# Altium project Farm_Pump.PrjPcb (part 2 of 2)

## Sheet STM32F038G6U6.SchDoc
size A4; SheetNumber: 12; SheetTotal: 13
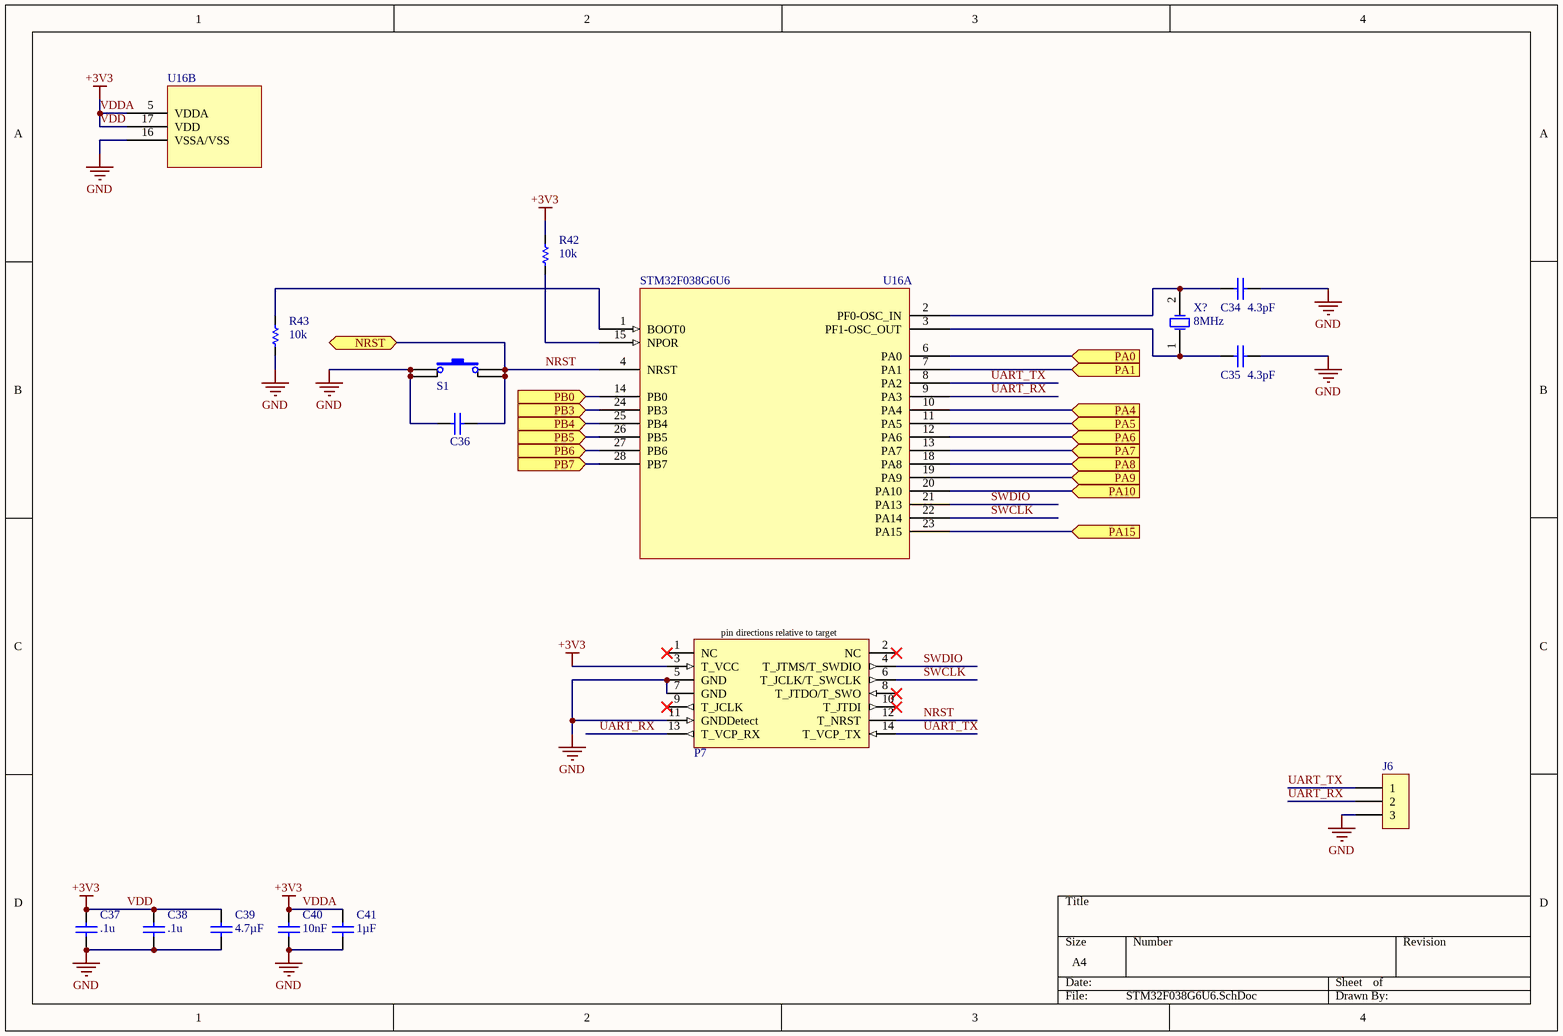
[diagram p12: STM32F038G6U6.SchDoc]

### Parts
C34  4.3pF  [0603C]
C35  4.3pF  [0603C]
C36  .1u  [0402c]  (value not drawn)
C37  .1u  [0402c]
C38  .1u  [0402c]
C39  4.7µF  [0603C]
C40  10nF  [0603C]
C41  1µF  [0603C]
J6  HDR3POS  [HDR 1x3 2.54MM]  (value not drawn)  (no BOM)
P7  HDR14POS  [Header_14pin_JTAG]  (value not drawn)
R42  10k  [0603R]
R43  10k  [0603R]
S1  SMT  [PTS645SM43SMTR92]  (value not drawn)
U16  STM32F038G6U6  [STM32F038G6U6]  (parts A,B of 2)
X?  8MHz  [OSC_2SM_3R2X1R5]

### Ports
NRST (bidir), PA0 (in), PA1 (in), PA4 (in), PA5 (in), PA6 (in), PA7 (in), PA8 (in), PA9 (in), PA10 (in), PA15 (in), PB0 (in), PB3 (in), PB4 (in), PB5 (in), PB6 (in), PB7 (in)

### Nets
GND: C34.2 C35.2 C36.1 C37.2 C38.2 C39.2 C40.2 C41.2 J6.3 P7.5(GND) P7.7(GND) P7.11(GNDDetect) R43.1 S1.1 S1.2 U16.16(VSSA/VSS)
VDD: C37.1 C38.1 C39.1 C40.1 C41.1 P7.3(T_VCC) R42.2 U16.5(VDDA) U16.17(VDD)  [also labelled +3V3, VDDA]
AC_Enabled: U16.25(PB4) ; port PB4
Alert: U16.23(PA15) ; port PA15
HV_SENSE_NEG: U16.7(PA1) ; port PA1
HV_SENSE_POS: U16.6(PA0) ; port PA0
I2C_SCL: U16.19(PA9) ; port PA9
I2C_SDA: U16.20(PA10) ; port PA10
NRST: C36.2 P7.12(T_NRST) S1.3 S1.4 U16.4(NRST) ; port NRST
ON_OFF: U16.26(PB5) ; port PB5
SWCLK: P7.6(T_JCLK/T_SWCLK) U16.22(PA14)
SWDIO: P7.4(T_JTMS/T_SWDIO) U16.21(PA13)
UART_RX: J6.2 P7.13(T_VCP_RX) U16.9(PA3)
UART_TX: J6.1 P7.14(T_VCP_TX) U16.8(PA2)
NetC34_1: C34.1 U16.2(PF0-OSC_IN) X?.2(OSC2)
NetC35_1: C35.1 U16.3(PF1-OSC_OUT) X?.1(OSC1)
NetR1_2: U16.24(PB3) ; port PB3
NetR2_1: U16.10(PA4) ; port PA4
NetR4_1: U16.11(PA5) ; port PA5
NetR6_2: U16.12(PA6) ; port PA6
NetR7_1: U16.13(PA7) ; port PA7
NetR20_1: U16.18(PA8) ; port PA8
NetR24_2: U16.27(PB6) ; port PB6
NetR42_1: R42.1 U16.15(NPOR)
NetR43_2: R43.2 U16.1(BOOT0)
NetR?#1_1: U16.14(PB0) ; port PB0
NetU3_7: U16.28(PB7) ; port PB7

Not connected (* = marked no-connect by the designer): P7 1(NC)* 2(NC)* 8(T_JTDO/T_SWO)* 9(T_JCLK)* 10(T_JTDI)*

### Notes on the sheet
- (in symbol 1005-0008) pin directions relative to target

### Library data of the parts
C34 C35 = 1000-0050: CAP CER 4.3PF 50V NPO 0603; Manufacturer: Yageo; Manufacturer Part Number: CC0603CRNPO9BN4R3; id: 377966; inventory_price: 0.02062; x_Link_Description: Datasheet; x_max_temp: 125°C; x_min_temp: -55°C; x_Tolerance: ±0.25pF; partnumber: 1000-0050; created_on: 31/03/2020 1:35:31 PM; parttype: Ceramic Capacitors; rohs: 1; updated_on: 24/08/2021 12:09:55 PM; x_Capacitance: 4.3pF; x_Link_URL: https://www.yageo.com/upload/media/product/productsearch/datasheet/mlcc/UPY-GP_NP0_16V-to-50V_18.pdf
C36-C38 = 1000-0015: CAP CER 0.1UF 16V X7R 0402; Manufacturer: TDK Corporation; Manufacturer Part Number: C1005X7R1C104K050BC; id: 310046; inventory_price: 0.0202; x_Capacitance: 0.1µF; x_Link_Description: Datasheet; x_max_temp: 125°C; x_min_temp: -55°C; x_Tolerance: ±10%; Value: .1u; partnumber: 1000-0015; created_on: 8/04/2019 9:50:39 AM; parttype: Ceramic Capacitors; rohs: 1; updated_on: 24/08/2021 12:09:53 PM; x_Link_URL: https://product.tdk.com/info/en/catalog/datasheets/mlcc_commercial_general_en.pdf?ref_disty=digikey
C39 = 1000-0095: CAP CER 4.7UF 16V X5R 0603; Manufacturer: TDK Corporation; Manufacturer Part Number: C1608X5R1C475K080AC; id: 427012; inventory_price: 0.1659; x_Link_Description: Datasheet; x_max_temp: 85°C; x_min_temp: -55°C; x_Tolerance: ±10%; partnumber: 1000-0095; created_on: 8/04/2021 12:25:47 PM; parttype: Ceramic Capacitors; rohs: 1; updated_on: 10/08/2021 1:17:22 PM; x_Capacitance: 4.7µF; x_Link_URL: https://product.tdk.com/info/en/catalog/datasheets/mlcc_commercial_general_en.pdf?ref_disty=digikey; x_temp_coef: X5R; x_Vol: 16V
C40 = 1000-0001: CAP CER 10000PF 50V X7R 0603; Manufacturer: Walsin Technology Corporation; Manufacturer Part Number: 0603B103K500CT; id: 376107; inventory_price: 0.1; x_current: Not Applicable; x_Link_Description: Datasheet; x_max_temp: 125°C; x_min_temp: -55°C; x_port_to_unleashed: No; x_Tolerance: ±10%; partnumber: 1000-0001; created_on: 4/03/2020 6:31:45 PM; parttype: Ceramic Capacitors; rohs: 1; updated_on: 9/02/2022 10:33:24 AM; x_Capacitance: 10000 pF; x_inductance: Not Applicable; x_Link_URL: https://www.vishay.com/docs/28548/vjw1bcbascomseries.pdf; x_Power: Not Applicable; x_resistance: Not Applicable; x_temp_coef: X7R; x_Vol: 50V
C41 = 1000-0094: CAP CER 1UF 25V X5R 0603; Manufacturer: Yageo; Manufacturer Part Number: CC0603KRX5R8BB105; id: 427010; inventory_price: 0.03236; x_Link_Description: Datasheet; x_max_temp: 85°C; x_min_temp: -55°C; x_Tolerance: ±10%; partnumber: 1000-0094; created_on: 8/04/2021 12:21:35 PM; parttype: Ceramic Capacitors; rohs: 1; updated_on: 24/08/2021 12:09:56 PM; x_Capacitance: 1µF; x_Link_URL: https://www.yageo.com/upload/media/product/productsearch/datasheet/mlcc/UPY-GPHC_X5R_4V-to-50V_26.pdf; x_temp_coef: X5R; x_Vol: 25V
J6 = 1005-0012: CONN HEADER VERT 3POS 2.54MM; Manufacturer: Sullins Connector Solutions; Manufacturer Part Number: PRPC003SAAN-RC; id: 377978; inventory_price: 0.25; x_Link_Description: datasheet; ComponentLink1Description: Datasheet; Mount: TH; Supplier 1: Digi-Key; Supplier Part Number 1: S1011EC-03-ND; partnumber: 1005-0012; created_on: 31/03/2020 1:35:33 PM; parttype: Rectangular Connectors - Headers, Male Pins; rohs: 1; updated_on: 11/08/2020 5:15:42 PM; x_Link_URL: https://drawings-pdf.s3.amazonaws.com/11636.pdf
P7 = 1005-0008: CONN HEADER SMD 14POS 1.27MM; Manufacturer Part Number: 3220-14-0300-00; Manufacturer: CNC Tech; id: 377974; inventory_price: 0.18; x_Link_Description: datasheet; ComponentLink1Description: Datasheet; ComponentLink1URL: http://cnctech.us/idcmatching2.pdf; Mount: SMT; Supplier 1: Digi-Key; Supplier Part Number 1: 1175-1632-ND; partnumber: 1005-0008; created_on: 31/03/2020 1:35:32 PM; parttype: Rectangular Connectors - Headers, Male Pins; rohs: 1; updated_on: 11/08/2020 5:15:42 PM; x_Link_URL: http://cnctech.us/pdfs/3220-XX-0300-00.pdf
R42 R43 = 1007-0057: RES SMD 10K OHM 1% 1/10W 0603; Manufacturer: Yageo; Manufacturer Part Number: RT0603FRE0710KL; id: 414003; inventory_price: 0.1; x_Capacitance: Not Applicable; x_Link_Description: Datasheet; x_max_temp: 155°C; x_min_temp: -55°C; x_port_to_unleashed: No; x_Power: 0.1W, 1/10W; x_resistance: 10 kOhms; x_temp_coef: ±50ppm/°C; partnumber: 1007-0057; created_on: 7/01/2021 3:05:37 PM; parttype: Chip Resistor - Surface Mount; rohs: 1; updated_on: 3/02/2022 2:42:16 PM; x_current: Not Applicable; x_inductance: Not Applicable; x_Link_URL: https://www.yageo.com/upload/media/product/productsearch/datasheet/rchip/PYu-RT_1-to-0.01_RoHS_L_12.pdf; x_Tolerance: ±1%; x_Vol: Not Applicable
S1 = 1082-0001: SWITCH TACTILE SPST-NO 0.05A 12V; Manufacturer Part Number: PTS645SM43SMTR92 LFS; Manufacturer: C&K; id: 377087; inventory_price: 0.42; x_Link_Description: Datasheet; x_port_to_unleashed: No; Supplier Part Number 1: CKN9112CT-ND; Mount: SMT; ComponentLink1Description: Datasheet; ComponentLink1URL: https://www.ckswitches.com/media/1471/pts645.pdf; partnumber: 1082-0001; created_on: 17/03/2020 11:40:16 AM; parttype: Tactile Switches; rohs: 1; updated_on: 27/04/2022 9:27:23 AM; x_Link_URL: https://www.ckswitches.com/media/1471/pts645.pdf
U16 = 1031-0008: IC MCU 32BIT 32KB FLASH 28UFQFPN; Mfr_Name: STMicroelectronics; id: 467446; inventory_price: 3.5; x_Capacitance: Not Applicable; x_Link_Description: Datasheet; x_max_temp: 85°C (TA); x_min_temp: -40°C; x_port_to_unleashed: Yes; Copyright: Copyright (C) 2022 Ultra Librarian. All rights reserved.; Manufacturer_Part_Number: STM32F038G6U6; Digi-Key_Part_Number_1: STM32F038G6U6-ND; RefDes: RefDes; Type: DEV; partnumber: 1031-0008; Manufacturer Part Number: STM32F038G6U6; created_on: 23/04/2022 8:42:40 PM; manufacturer: STMicroelectronics; parttype: Embedded - Microcontrollers; rohs: 1; updated_on: 23/04/2022 8:42:50 PM; x_current: Not Applicable; x_inductance: Not Applicable; x_Link_URL: https://www.st.com/content/ccc/resource/technical/document/datasheet/5f/5d/72/7b/c3/2d/46/54/DM00110868.pdf/files/DM00110868.pdf/jcr:content/translations/en.DM00110868.pdf; x_Power: Not Applicable; x_resistance: Not Applicable; x_temp_coef: Not Applicable; x_Tolerance: Not Applicable; x_Vol: Not Applicable
X? = 1097-0002: CRYSTAL 8.0000MHZ 8PF SMD; Manufacturer: NDK America, Inc.; Manufacturer Part Number: NX3225GD-8MHZ-STD-CRA-3; id: 377983; inventory_price: 0.8868; x_Link_Description: Datasheet; x_Tolerance: 50ppm; ComponentLink1Description: Datasheet; ComponentLink1URL: http://www.ndk.com/images/products/catalog/c_NX3225GD-STD-CRA-3_e.pdf; Mount: SMT; Supplier 1: Digi-Key; Supplier Part Number 1: 644-1178-1-ND; Tolerance: 8pF; partnumber: 1097-0002; created_on: 31/03/2020 1:35:33 PM; parttype: Crystals; rohs: 1; updated_on: 13/08/2021 2:17:15 PM; x_Link_URL: https://www.ndk.com/en/

## Nets that join several sheets
+5V: Farm_Pump (R18.2 R19.2), DC_Volt_Sense (C14.2 L2.1), Batt_Charge (6 pins), Analog (J1.1 J2.1), Voltage_Current_Sense (C32.1 C33.2 L4.1), LED (C42.2 U17.4 U17.6), LoRa_Module (J4.6)
+12VDC: Gate_Driver (C19.1 L3.1), PV_Relay (D7.K D8.K K2.A1 K3.A1), Batt_Charge (C7.2 R?#1.2 U2.1), AC_Relay (D1.K K1.2), DCDC (U7.4)
DC_NEG_OUT: Farm_Pump (P3.1), PV_Relay (K3.14), DC_Volt_Sense (9 pins), DCDC (D5.K)
GND: Farm_Pump (J3.2 J3.4), Gate_Driver (5 pins), PV_Relay (R24.1 R25.1 U10.2 U11.2), DC_Volt_Sense (5 pins), Batt_Charge (21 pins), AC_Relay (R1.1 U1.2), Analog (R3.1 R5.1 R6.3 R8.1), Voltage_Current_Sense (5 pins), DCDC (U7.3), LED (C42.1 U17.11 U17.17), LoRa_Module (6 pins), STM32F038G6U6 (16 pins)
ISOGND: PV_Relay (K3.11), AC_Relay (K1.3), Voltage_Current_Sense (17 pins)
VDD: DC_Volt_Sense (C17.2 U6.8), Batt_Charge (C10.2 U4.1 U4.2), Analog (R6.1), Voltage_Current_Sense (C24.2 R30.2 R31.2 U13.16), STM32F038G6U6 (9 pins)
AC_Enabled: Farm_Pump (J3.1 R19.1), STM32F038G6U6 (U16.25)
AC_LIVE_IN: Farm_Pump (P5.1), AC_Relay (K1.6), DCDC (D4.K U7.2)
AC_NEUTRAL_IN: Farm_Pump (P6.1), AC_Relay (K1.5), DCDC (D5.A U7.1)
Alert: Voltage_Current_Sense (U13.13), STM32F038G6U6 (U16.23)
DC_POS_IN: Farm_Pump (P1.1), PV_Relay (K2.14), DC_Volt_Sense (R13.1), DCDC (D4.A)
HV_SENSE_NEG: DC_Volt_Sense (C16.1 U6.6), STM32F038G6U6 (U16.7)
HV_SENSE_POS: DC_Volt_Sense (C16.2 U6.7), STM32F038G6U6 (U16.6)
I2C_SCL: Voltage_Current_Sense (R30.1 U13.11), LED (U17.3), LoRa_Module (J5.3), STM32F038G6U6 (U16.19)
I2C_SDA: Voltage_Current_Sense (R31.1 U13.14), LED (U17.2), LoRa_Module (J5.5), STM32F038G6U6 (U16.20)
NetD6_K: Farm_Pump (Q1.1), Gate_Driver (D6.K R21.2 R23.2)
NetR1_2: AC_Relay (R1.2 U1.1), STM32F038G6U6 (U16.24)
NetR2_1: Analog (R2.1 R3.2), STM32F038G6U6 (U16.10)
NetR4_1: Analog (R4.1 R5.2), STM32F038G6U6 (U16.11)
NetR6_2: Analog (R6.2), STM32F038G6U6 (U16.12)
NetR7_1: Analog (R7.1 R8.2), STM32F038G6U6 (U16.13)
NetR20_1: Gate_Driver (R20.1 R22.2), STM32F038G6U6 (U16.18)
NetR24_2: PV_Relay (R24.2 R25.2 U10.1 U11.1), STM32F038G6U6 (U16.27)
NetR?#1_1: Batt_Charge (R?#1.1 R?#2.2), STM32F038G6U6 (U16.14)
NetU3_7: Batt_Charge (U3.7), STM32F038G6U6 (U16.28)
NRST: LoRa_Module (J4.14), STM32F038G6U6 (5 pins)
ON_OFF: Farm_Pump (J3.3 R18.1), STM32F038G6U6 (U16.26)
Pump_In: Farm_Pump (P2.1), PV_Relay (K2.11), AC_Relay (K1.4), Voltage_Current_Sense (R26.2)
Return: Farm_Pump (Q1.3), Gate_Driver (6 pins), Voltage_Current_Sense (R39.2)
VBAT: Batt_Charge (12 pins), Analog (R7.2)